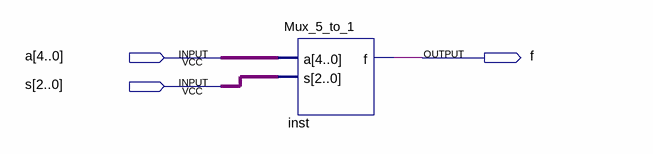
[diagram p0: schematic sheet]
// Quartus schematic Block_Mux_5_to_1.bdf as structural Verilog: 1 symbols, 3 pins
module Block_Mux_5_to_1 (
  input  [4:0] a,
  input  [2:0] s,
  output f
);

  Mux_5_to_1 inst (.a(a), .s(s), .f(f));
endmodule
